# EAGLE design Cellphone-Detector-2-LM358 (EAGLE 7.2.0)
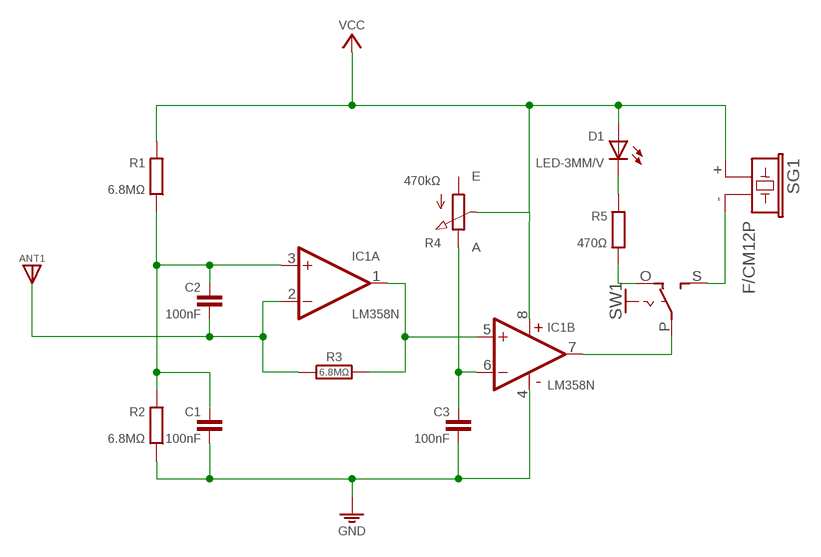
[diagram p0: schematic, sheet 1]

## Parts
ANT1  ANT  [SPAD]
C1  100nF  C025-024X044  [C025-024X044]
C2  100nF  C025-024X044  [C025-024X044]
C3  100nF  C025-024X044  [C025-024X044]
D1  LED-3MM/V  [LED_3MM/V]
IC1  LM358N  [DIL08]
R1  6.8MΩ  R0204/7-V  [0204/7-V]
R2  6.8MΩ  R0204/2V  [0204/2V]
R3  6.8MΩ  R-H0202/2V  [0202/2V]
R4  470kΩ  POT-V  [POT-V]
R5  470Ω  R0204/10-V  [0204/10-V]
S1  VCC_GNDPWR-R  [PWR-R]
SG1  F/CM12P  [F/CM12P]
SW1  SL-SW-1P-2T-V  [SLSW-1P2T-V]

## Nets
ANT: ANT1.1 C2.2 IC1.2(A:-IN) R3.1
GND: C1.2 C3.2 IC1.4(P:V-) R2.2 S1.1
N$1: C3.1 IC1.6(B:-IN) R4.E
N$2: SG1.- SW1.S
N$3: IC1.7(B:OUT) SW1.P
N$4: C1.1 C2.1 IC1.3(A:+IN) R1.2 R2.1
N$8: D1.K(C) R5.1
OUT: R5.2 SW1.O
SIG: IC1.1(A:OUT) IC1.5(B:+IN) R3.2
VCC: D1.A IC1.8(P:V+) R1.1 R4.S S1.2 SG1.+
Unconnected: R4.A

## Library data of the parts
ANT1 = pad:ANT
C1-C3 = c:C: CAPACITOR, European symbol
D1 = d:LED
IC1 = ic:LM358: OP AMP also LM158; LM258; LM2904 Source: http://cache.national.com/ds/LM/LM158.pdf
R1 R2 R5 = r:R: RESISTOR, European symbol
R3 = r:R-H
R4 = r:POT
S1 = pad:VCC_GND
SG1 = buzzer:F/CM12P: BUZZER Source: Buerklin; OC_FARNELL: unknown; OC_NEWARK: unknown
SW1 = sw:SL-SW-1P-2T

## Board
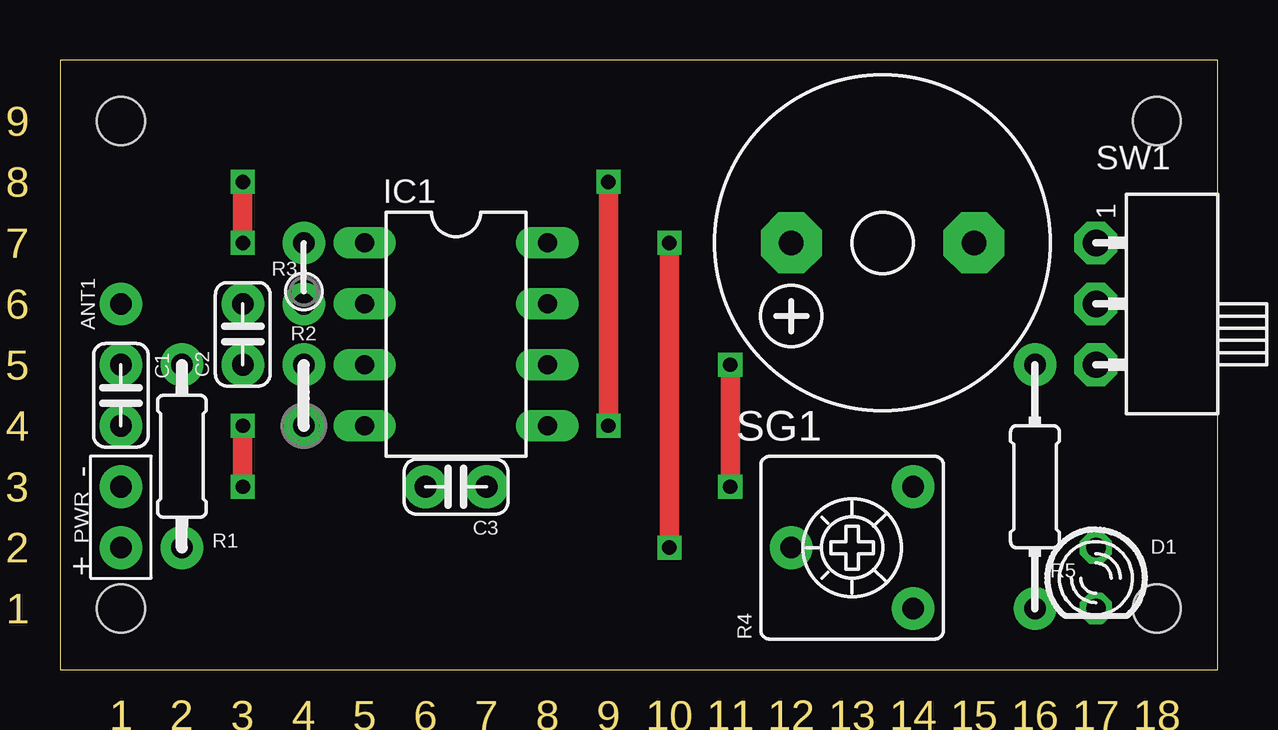
[diagram p1: board, top side]
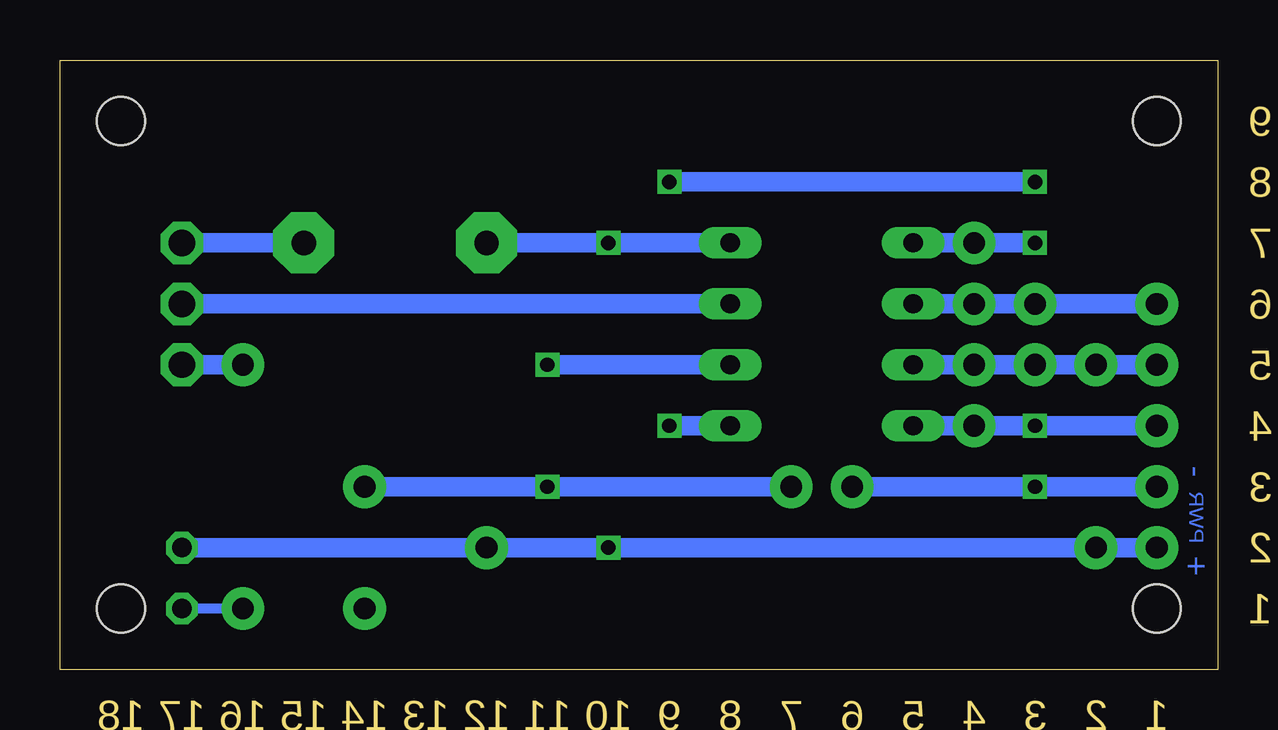
[diagram p2: board, bottom side, seen from below]

Size 48.26 x 25.4 mm. Coordinates in mm from the lower left corner, seen from the top.
Outline: 0,0 48.26,0 48.26,25.4 0,25.4 0,0
Copper layers (1*16): Top 0.035mm / dielectric 1.5mm / Bottom 0.035mm
Design rules "default": minimum track width 10mil, minimum drill 24mil, track to track 8mil, track to pad 8mil, pad to pad 8mil, via to via 8mil, smd to smd 8mil, copper to edge 40mil, drill to drill 8mil, minimum pad ring 10mil, minimum via ring 8mil, stop-mask expansion 4mil, vias tented up to drill 0mil, thermal gap 10mil
Holes 2 mm at 2.54,22.86 2.54,2.54 45.72,22.86 45.72,2.54

### Footprints (pad centres in the part's own frame; a part is rotated, then mirrored left to right if it is on the bottom)
SPAD = drill 0.9 pad 1.778: 1 0,0
C025-024X044 = drill 0.9 pad 1.778: 1 -1.27,0; 2 1.27,0
LED_3MM/V = drill 0.813 pad 1.27 octagon: A 0,1.27; K 0,-1.27
DIL08 = drill 0.8 pad 1.27 long: 1 -3.81,3.81; 2 -3.81,1.27; 3 -3.81,-1.27; 4 -3.81,-3.81; 5 3.81,-3.81; 6 3.81,-1.27; 7 3.81,1.27; 8 3.81,3.81
0204/7-V = drill 0.9 pad 1.778: 1 0,3.81; 2 0,-3.81
0204/2V = drill 0.9 pad 1.778: 1 0,1.27; 2 0,-1.27
0202/2V = drill 0.9 pad 1.778: 1 0,-1.27; 2 0,1.27
POT-V = drill 0.9 pad 1.778: A -2.54,-2.54; E 2.54,-2.54; S 0,2.54
0204/10-V = drill 0.9 pad 1.778: 1 0,5.08; 2 0,-5.08
PWR-R = drill 0.9 pad 1.778: 1 0,-1.27; 2 0,1.27
F/CM12P = drill 1.016 pad 2.54 octagon: + 3.81,0; - -3.81,0
SLSW-1P2T-V = drill 1.1 pad 1.778 octagon: O -5.08,-2.54; P -5.08,0; S -5.08,2.54

### Placement (x,y rotation side)
ANT1  2.54,15.24 0 top
C1  2.54,11.43 270 top
C2  7.62,13.97 90 top
C3  16.51,7.62 180 top
D1  43.18,3.81 0 top
IC1  16.51,13.97 0 top
R1  5.08,8.89 180 top
R2  10.16,11.43 0 top
R3  10.16,16.51 0 top
R4  33.02,5.08 90 top
R5  40.64,7.62 180 top
S1  2.54,6.35 180 top
SG1  34.29,17.78 180 top
SW1  48.26,15.24 0 top

### Tracks (layer width: path | path; a pad name or v marks a point on that pad's centre or on a via)
ANT
  Bottom 0.813: IC1.2 R3.1 C2.2 ANT1.1
GND  (via drill 0.6)
  Top 0.813: v7.62,10.16 v7.62,7.62
  Bottom 0.813: C3.2 v7.62,7.62 S1.1 | C1.2 v7.62,10.16 R2.2 IC1.4
N$1  (via drill 0.6)
  Top 0.813: v27.94,7.62 v27.94,12.7
  Bottom 0.813: v27.94,12.7 IC1.6 | C3.1 v27.94,7.62 R4.E
N$2
  Bottom 0.813: SW1.S SG1.-
N$3
  Bottom 0.813: IC1.7 SW1.P
N$4
  Bottom 0.813: IC1.3 C2.1 R2.1 R1.2 C1.1
N$8
  Bottom 0.406: R5.1 D1.K
OUT
  Bottom 0.813: R5.2 SW1.O
SIG  (via drill 0.6)
  Top 0.813: v7.62,17.78 v7.62,20.32 | v22.86,20.32 v22.86,10.16
  Bottom 0.813: IC1.1 R3.2 v7.62,17.78 | v7.62,20.32 v22.86,20.32 | v22.86,10.16 IC1.5
VCC  (via drill 0.6)
  Top 0.813: v25.4,5.08 v25.4,17.78
  Bottom 0.813: IC1.8 v25.4,17.78 SG1.+ | S1.2 R1.1 v25.4,5.08 R4.S D1.A

### Text on the board
Dimension: 9 | 8 | 7 | 6 | 5 | 4 | 3 | 2 | 1 | 1 | 2 | 3 | 4 | 5 | 6 | 7 | 8 | 9 | 10 | 11 | 12 | 13 | 14 | 15 | 16 | 17 | 18